# Altium project drone.PrjPcb
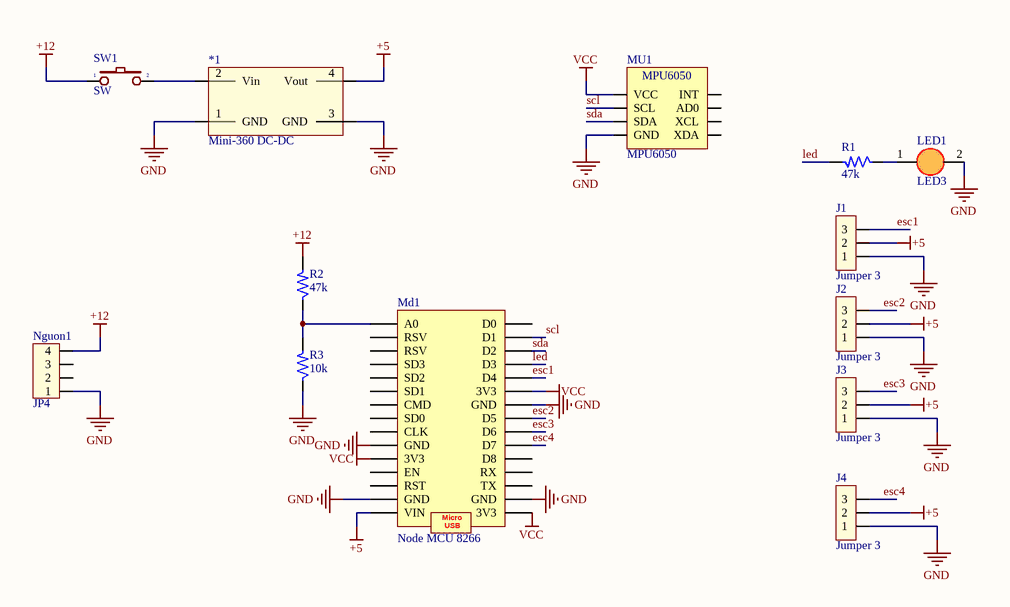
[diagram p0: Sheet2.SchDoc]
1 sheet, 13 parts. Net scope: global (net labels, ports and power ports of the same name join across sheets).
Board file: PCB1.PcbDoc

## Sheet Sheet2.SchDoc
size A4; SheetNumber: 1; SheetTotal: 1

### Parts
*1  Mini-360 DC-DC  [Mini-360]
J1  Jumper 3  [JP3]
J2  Jumper 3  [JP3]
J3  Jumper 3  [JP3]
J4  Jumper 3  [JP3]
LED1  LED3  [LED3mm]
Md1  Node MCU 8266  [NODEMCU_ESP8266_CH340]
MU1  MPU6050  [MPU6050]
Nguon1  JP4  [CON4]
R1  47k  [R1/8W]
R2  47k  [R1/8W]
R3  10k  [R1/8W]
SW1  SW  [SW2]

### Nets
+5: *1.4(Vout) J1.2 J2.2 J3.2 J4.2 Md1.VIN
+12: Nguon1.4 R2.2 SW1.1
GND: *1.1(GND) *1.3(GND) J1.1 J2.1 J3.1 J4.1 LED1.2(K) Md1.GND MU1.2(GND) Nguon1.1 R3.1
VCC: Md1.3V3 MU1.1(VCC)
esc1: J1.3 Md1.D4
esc2: J2.3 Md1.D5
esc3: J3.3 Md1.D6
esc4: J4.3 Md1.D7
led: Md1.D3 R1.2
scl: Md1.D1 MU1.3(SCL)
sda: Md1.D2 MU1.4(SDA)
Net*1_2: *1.2(Vin) SW1.2
NetLED1_1: LED1.1(A) R1.1
NetMd1_A0: Md1.A0 R2.1 R3.2

Not connected (* = marked no-connect by the designer): Md1 CLK CMD D0 D8 EN RST RSV RX SD0 SD1 SD2 SD3 TX; MU1 5(XDA) 6(XCL) 7(AD0) 8(INT); Nguon1 2 3

### Notes on the sheet
- (in symbol NodeMCU_ESP8266) Micro; USB

### Library data of the parts
J1-J4 = JP3: Value: J3
LED1 = LED 3mm
Md1 = NodeMCU_ESP8266
MU1 = MPU6050: Manufacturer: W¨¹rth Elektronik eiSos GmbH; partNo: 613004143121; ComponentLink1 Description: Manufacturer; ComponentLink2 Description: Datasheet; NoPins: 04; Created Date: 29 March 2013; ComponentLink1URL: http://www.we-online.com; ComponentLink2URL: http://katalog.we-online.de/em/datasheet/6130xx143121.pdf; Created by: Karrer Zheng
Nguon1 = Con4: Connector 4; Value: Connector 4
R1-R3 = R: Resistor 1/4W; Value: R1/4W - 1K
SW1 = SW2: Switch button 2 pin; Value: SW chip 2 pin